# EasyEDA schematic SCH_T-Info Rail DIN_2021-09-16.json
TITLE: T-InfoDIN - Module Télé-Information en boitier DIN; REV: 1.1; Date: 2021-05-20; Sheet: 1/1; Drawn By: TrimVa; Company: Tech4You
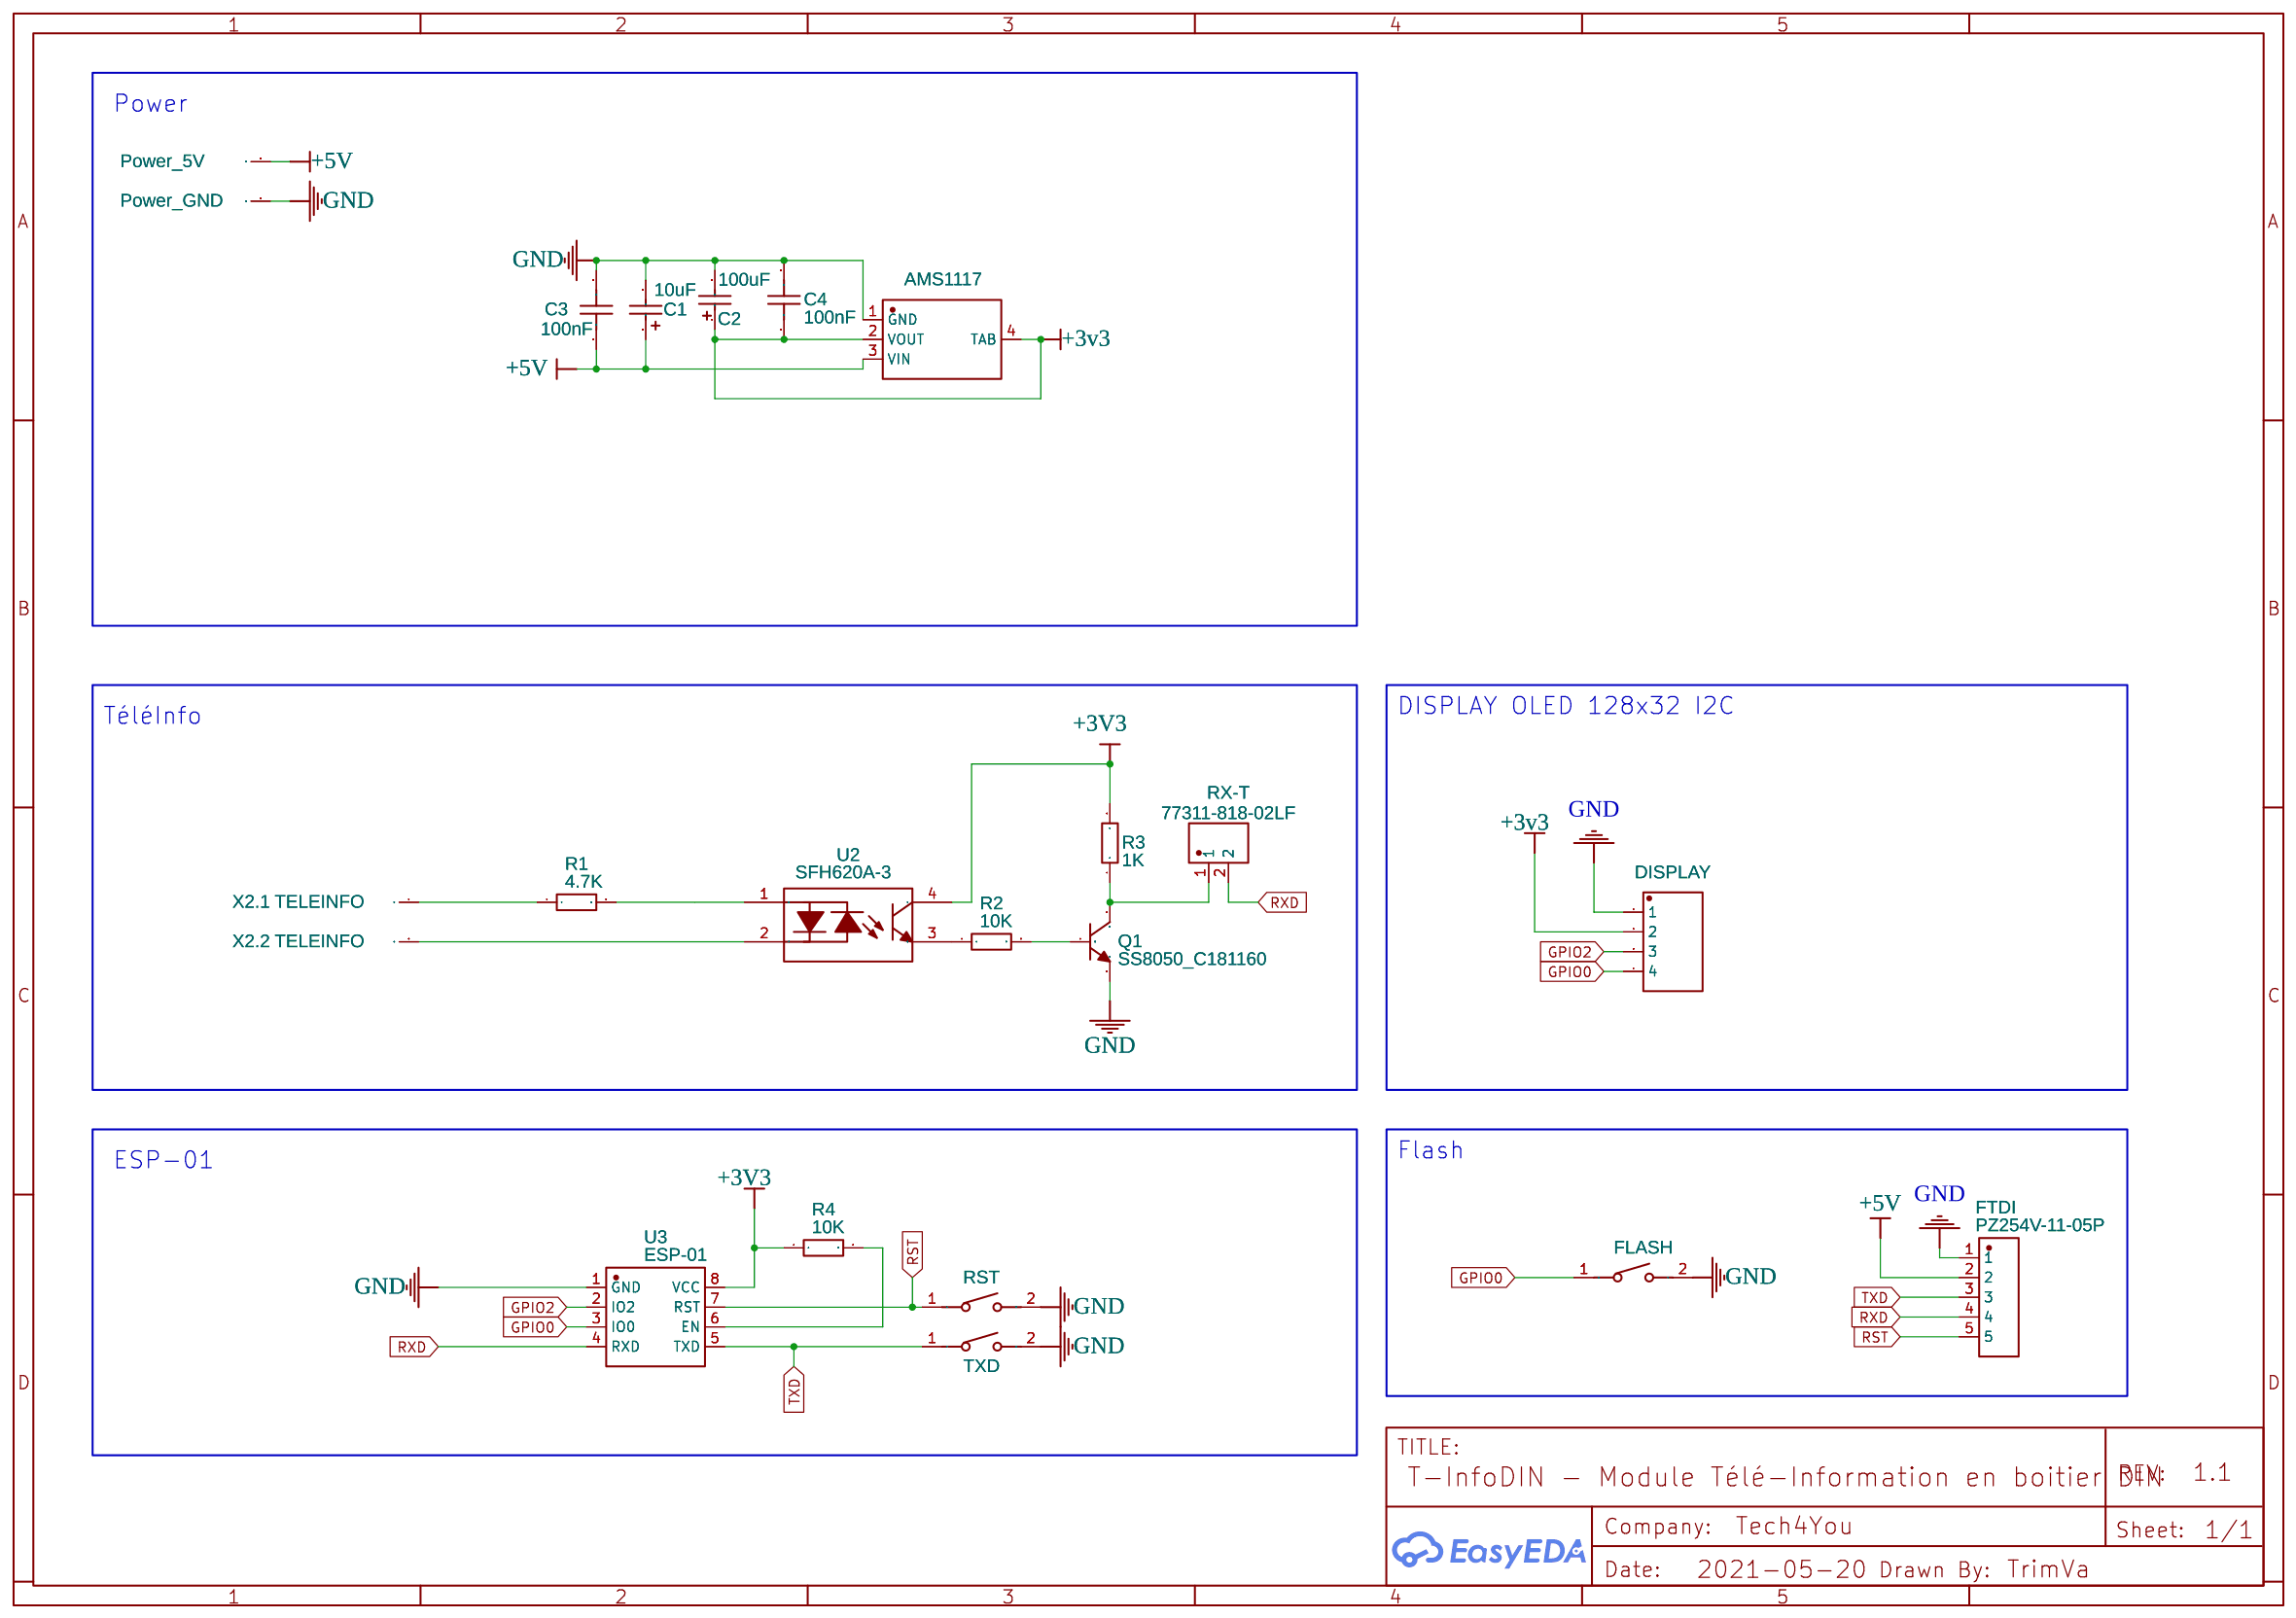
[diagram p0: schematic sheet]

## Parts
AMS1117  AMS1117-3.3_C351784  [SOT-223-3_L6.5-W3.4-P2.30-LS7.0-BR]
C1  10uF  [CAP-SMD_L3.2-W1.6-R-RD]
C2  100uF  [CAP-SMD_L3.2-W1.6-R-RD]
C3  100nF  [C0402]
C4  100nF  [C0402]
DISPLAY  Header-Male-2.54_1x4  [HDR-TH_4P-P2.54-V-M]
FLASH  TS-1088-AR02516  [SW-SMD_L4.0-W2.9-LS4.8-1]
FTDI  PZ254V-11-05P  [HDR-TH_5P-P2.54-V-M]
Q1  SS8050_C181160  [SOT-23-3_L2.9-W1.6-P1.90-LS2.8-BR]
R1  4.7K  [R0805]
R2  10K  [R0805]
R3  1K  [R0805]
R4  10K  [R0805]
RST  TS-1088-AR02516  [SW-SMD_L4.0-W2.9-LS4.8-1]
RX-T  77311-818-02LF  [HDR-TH_P2.54-V]
TXD  TS-1088-AR02516  [SW-SMD_L4.0-W2.9-LS4.8-1]
U2  SFH620A-3  [DIP-4_L6.6-W4.7-P2.54-LS10.5-BL]
U3  ESP-01  [WIFIM-TH_8P-L24.7-W14.4-P2.54]
X1  Power_GND  [W237-102]  (sections 1,2)
X2  TELEINFO  [W237-102]  (sections 1,2)

## Library data of the parts
AMS1117 = AMS1117-3.3_C351784: Supplier: LCSC; Supplier Part: C351784; Manufacturer: PUOLOP; Manufacturer Part: AMS1117-3.3; Contributor: LCSC; JLCPCB Part Class: Extended Part
C1 = TAJA106K016RNJ: Supplier: LCSC; Manufacturer: AVX; Supplier Part: C7171; JLCPCB Part Class: Basic Part
C2 = T490A107M006ATE800: Supplier: LCSC; Manufacturer: KEMET; Supplier Part: C122251; JLCPCB Part Class: Extended Part
C3 C4 = TCC0402X7R104K160AT: Supplier: LCSC; Supplier Part: C392963; Manufacturer: CCTC; Contributor: LCSC; JLCPCB Part Class: Extended Part
DISPLAY = Header-Male-2.54_1x4: Supplier: LCSC; Manufacturer: Ckmtw; Manufacturer Part: 210S-1*4P L=11.6MMGold-plated black; Contributor: LCSC; Supplier Part: C124378; JLCPCB Part Class: Extended Part
FLASH RST TXD = TS-1088-AR02516: Supplier: LCSC; Supplier Part: C720478; Manufacturer: XUNPU; Contributor: LCSC; JLCPCB Part Class: Extended Part
FTDI = PZ254V-11-05P: Supplier: LCSC; Supplier Part: C492404; Manufacturer: XFCN; Contributor: LCSC; JLCPCB Part Class: Extended Part
Q1 = SS8050_C181160: Supplier: LCSC; Manufacturer: Hottech; Manufacturer Part: SS8050; Contributor: LCSC; Supplier Part: C181160; JLCPCB Part Class: Extended Part
R1 = 0805W8J0472T5E: Supplier: LCSC; Manufacturer: UniOhm; Supplier Part: C26022; JLCPCB Part Class: Extended Part
R2 R4 = 0805W8J0103T5E: Supplier: LCSC; Manufacturer: UniOhm; Supplier Part: C25612; JLCPCB Part Class: Extended Part
R3 = 0805W8J0102T5E: Supplier: LCSC; Manufacturer: UniOhm; Supplier Part: C25623; JLCPCB Part Class: Extended Part
RX-T = 77311-818-02LF: Supplier: LCSC; Supplier Part: C464599; Manufacturer: Amphenol ICC; Contributor: LCSC; JLCPCB Part Class: Extended Part
U2 = SFH620A-3: Supplier: LCSC; Supplier Part: C500642; Manufacturer: Vishay Intertech; Contributor: LCSC; JLCPCB Part Class: Extended Part
U3 = ESP-01: Supplier: LCSC; Supplier Part: C503581; Manufacturer: Ai-Thinker; Contributor: LCSC; JLCPCB Part Class: Extended Part
X1 X2 = W237-102: Contributor: TrimVa; subpart_no: 1

## Nets
+3V3: R3.2 R4.1 U2.4 U3.8(VCC)
+3v3: AMS1117.2(VOUT) AMS1117.4(TAB) C2.1 C4.1 DISPLAY.2
+5V: AMS1117.3(VIN) C1.1 C3.1 FTDI.2 X1.2(KL)
GND: AMS1117.1(GND) C1.2 C2.2 C3.2 C4.2 DISPLAY.1 FLASH.2 FTDI.1 Q1.2(E) RST.2 TXD.2 U3.1(GND) X1.1(KL)
GPIO0: DISPLAY.4 FLASH.1 U3.3(IO0)
GPIO2: DISPLAY.3 U3.2(IO2)
RST: FTDI.5 RST.1 U3.7(RST)
RXD: FTDI.4 RX-T.2 U3.4(RXD)
TXD: FTDI.3 TXD.1 U3.5(TXD)
Net-(Q1-1): Q1.1(B) R2.2
Net-(Q1-3): Q1.3(C) R3.1 RX-T.1
Net-(R1-1): R1.1 X2.1(KL)
Net-(R1-2): R1.2 U2.1
Net-(R2-1): R2.1 U2.3
Net-(R4-2): R4.2 U3.6(EN)
Net-(U2-2): U2.2 X2.2(KL)

## Notes on the sheet
- Power
- DISPLAY OLED 128x32 I2C
- TéléInfo
- Flash
- ESP-01
